# EAGLE board CFT-PB3-revB (EAGLE 5.11), part 1 of 2
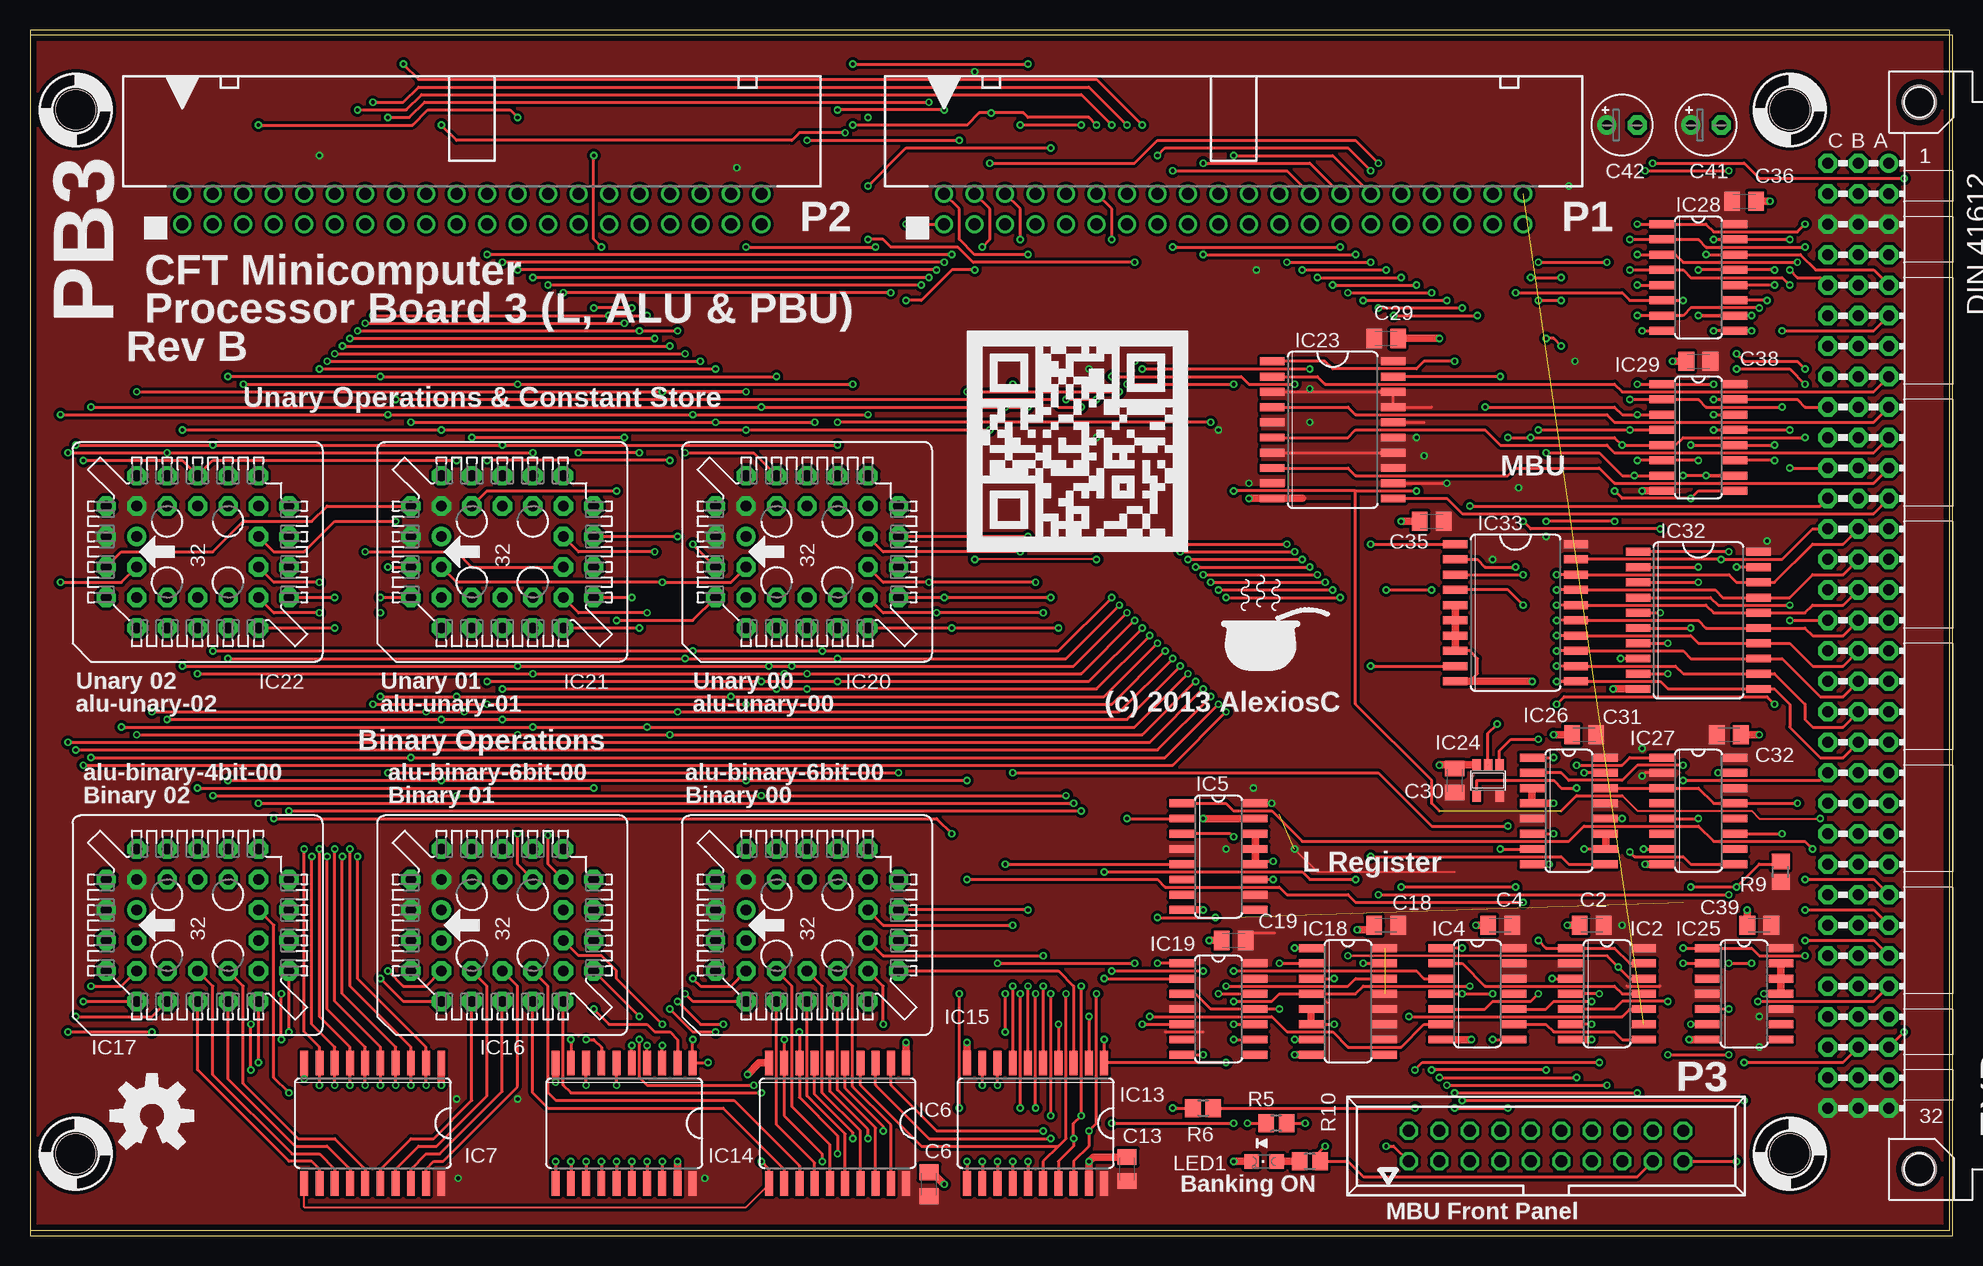
[diagram p7: board, top side]
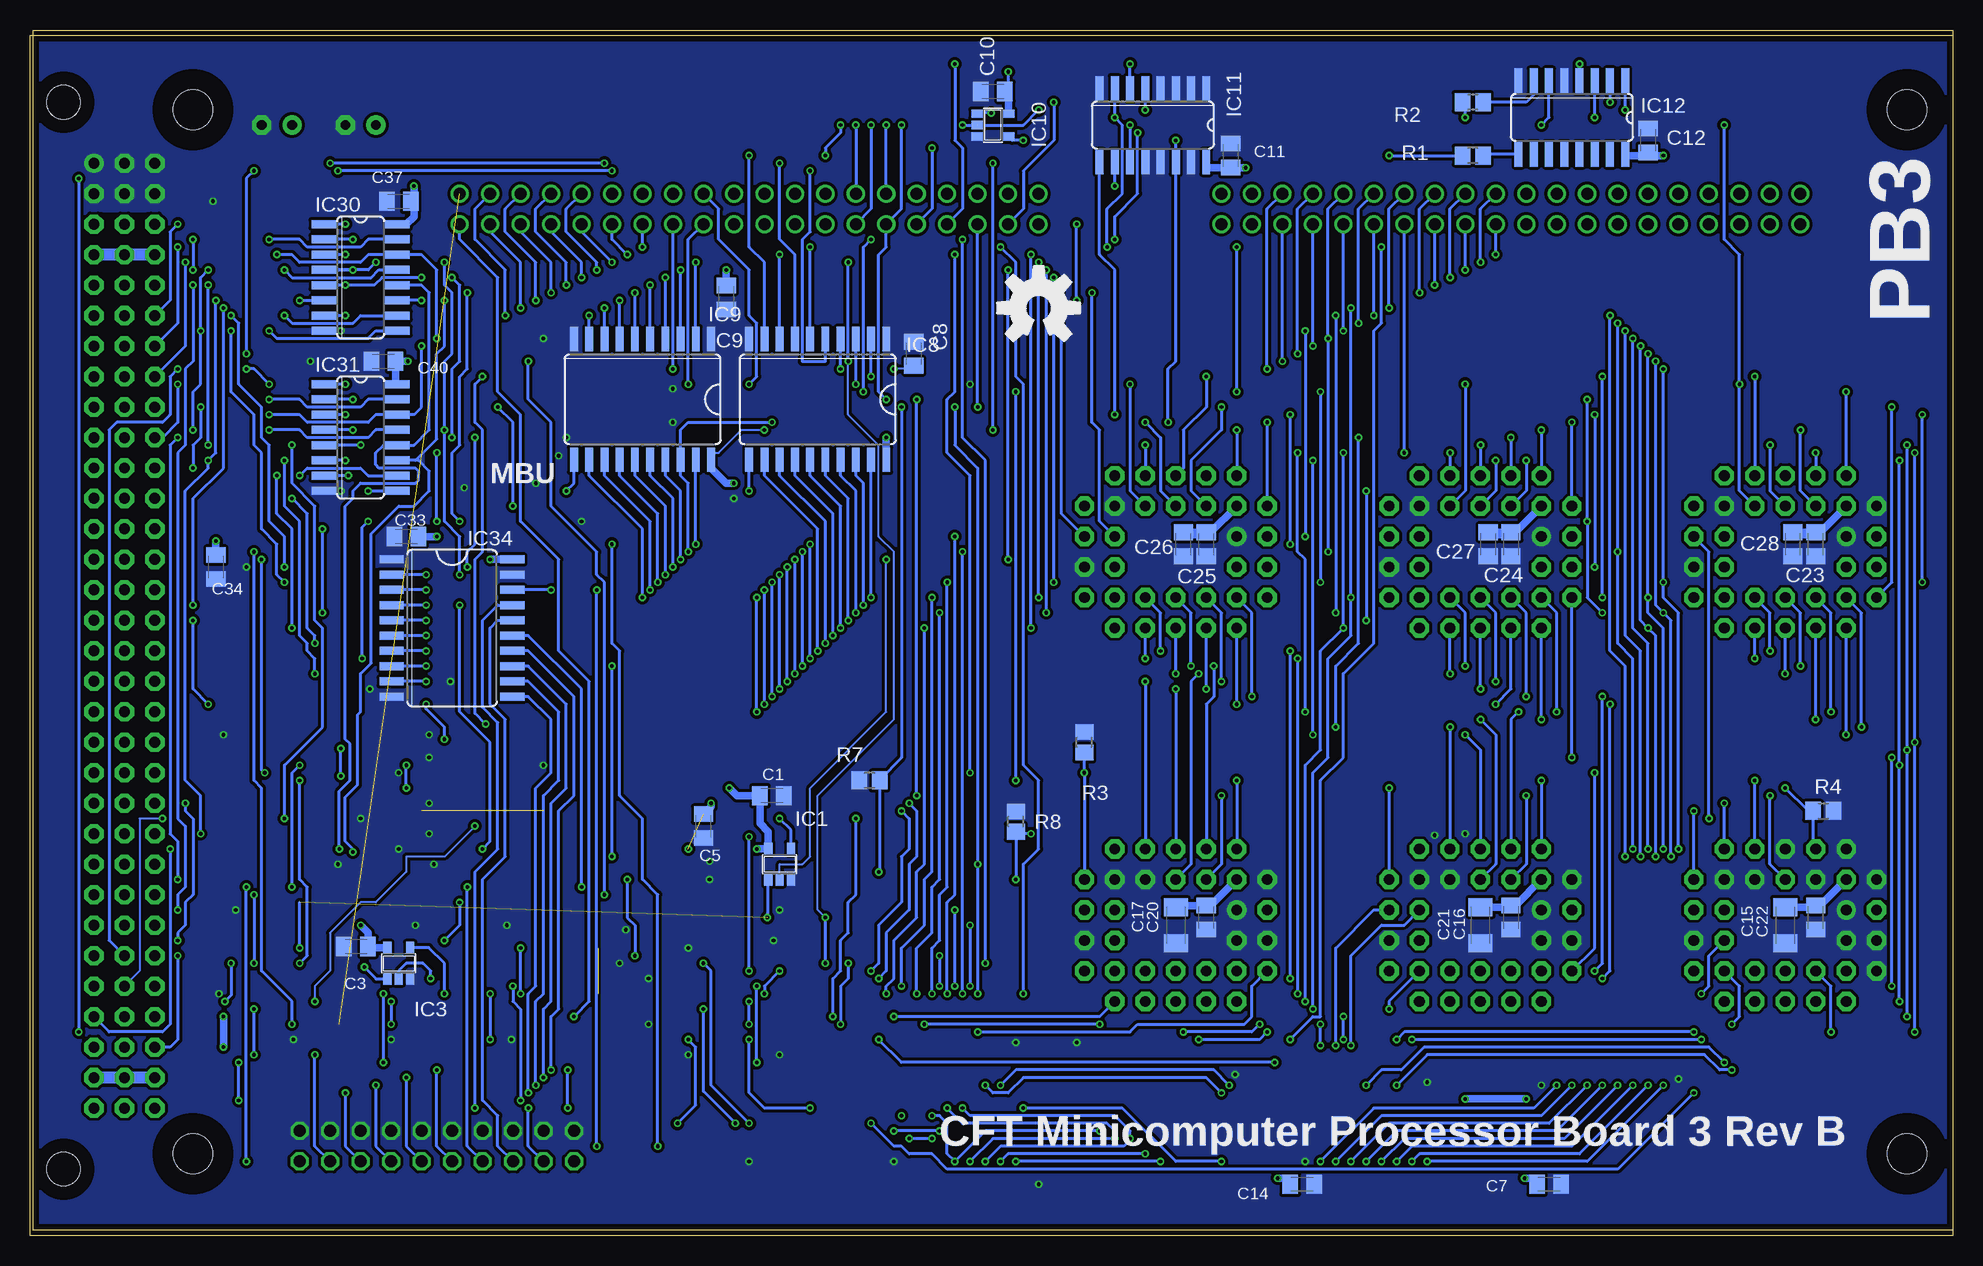
[diagram p8: board, bottom side, seen from below]

Size 160 x 100 mm. Coordinates in mm from the lower left corner, seen from the top.
Outline: 0,0 160,0 160,100 0,100 0,0
Copper layers (1*16): Top 0.035mm / dielectric 1.5mm / Bottom 0.035mm
Design rules "smart-prototyping *": minimum track width 7mil, minimum drill 12mil, track to track 7mil, track to pad 7mil, pad to pad 7mil, via to via 7mil, smd to smd 0mil, copper to edge 20mil, drill to drill 10mil, minimum pad ring 10mil, minimum via ring 6mil, stop-mask expansion 2mil, vias tented up to drill 25mil, thermal gap 10mil
Net classes: 0 default: width 0.152 mm, clearance 0.152 mm; 1 low power: width 0.152 mm, clearance 0.152 mm; 2 LED power: width 0.152 mm, clearance 0.152 mm
bRestrict: area 150.5,83.3 to 154.3,84.6

## Footprints (pad centres in the part's own frame; a part is rotated, then mirrored left to right if it is on the bottom)
C0805K = smd 1.3 x 1.6: 1 -1,0; 2 1,0
C1206K = smd 1.5 x 2: 1 -1.5,0; 2 1.5,0
E2,5-5 = drill 0.813 pad 1.6 round: + -1.27,0 | drill 0.813 pad 1.6 octagon: - 1.27,0
VG96K = drill 0.914 pad 1.6 round: A1 154.94,39.37 | drill 0.914 pad 1.6 octagon: A2 154.94,36.83; A3 154.94,34.29; A4 154.94,31.75; A5 154.94,29.21; A6 154.94,26.67; A7 154.94,24.13; A8 154.94,21.59; A9 154.94,19.05; A10 154.94,16.51; A11 154.94,13.97; A12 154.94,11.43; A13 154.94,8.89; A14 154.94,6.35; A15 154.94,3.81; A16 154.94,1.27; A17 154.94,-1.27; A18 154.94,-3.81; A19 154.94,-6.35; A20 154.94,-8.89; A21 154.94,-11.43; A22 154.94,-13.97; A23 154.94,-16.51; A24 154.94,-19.05; A25 154.94,-21.59; A26 154.94,-24.13; A27 154.94,-26.67; A28 154.94,-29.21; A29 154.94,-31.75; A30 154.94,-34.29; A31 154.94,-36.83; A32 154.94,-39.37; B1 152.4,39.37; B2 152.4,36.83; B3 152.4,34.29; B4 152.4,31.75; B5 152.4,29.21; B6 152.4,26.67; B7 152.4,24.13; B8 152.4,21.59; B9 152.4,19.05; B10 152.4,16.51; B11 152.4,13.97; B12 152.4,11.43; B13 152.4,8.89; B14 152.4,6.35; B15 152.4,3.81; B16 152.4,1.27; B17 152.4,-1.27; B18 152.4,-3.81; B19 152.4,-6.35; B20 152.4,-8.89; B21 152.4,-11.43; B22 152.4,-13.97; B23 152.4,-16.51; B24 152.4,-19.05; B25 152.4,-21.59; B26 152.4,-24.13; B27 152.4,-26.67; B28 152.4,-29.21; B29 152.4,-31.75; B30 152.4,-34.29; B31 152.4,-36.83; B32 152.4,-39.37; C1 149.86,39.37; C2 149.86,36.83; C3 149.86,34.29; C4 149.86,31.75; C5 149.86,29.21; C6 149.86,26.67; C7 149.86,24.13; C8 149.86,21.59; C9 149.86,19.05; C10 149.86,16.51; C11 149.86,13.97; C12 149.86,11.43; C13 149.86,8.89; C14 149.86,6.35; C15 149.86,3.81; C16 149.86,1.27; C17 149.86,-1.27; C18 149.86,-3.81; C19 149.86,-6.35; C20 149.86,-8.89; C21 149.86,-11.43; C22 149.86,-13.97; C23 149.86,-16.51; C24 149.86,-19.05; C25 149.86,-21.59; C26 149.86,-24.13; C27 149.86,-26.67; C28 149.86,-29.21; C29 149.86,-31.75; C30 149.86,-34.29; C31 149.86,-36.83; C32 149.86,-39.37 | hole 2.794: 157.48,44.45; 157.48,-44.45
SOT23-5 = smd 0.69 x 0.99: 1 -0.95,-1.29; 2 0,-1.29; 3 0.95,-1.29; 4 0.95,1.3; 5 -0.95,1.3
SO14 = smd 0.66 x 2.032: 1 -3.81,-3.073; 2 -2.54,-3.073; 3 -1.27,-3.073; 4 0,-3.073; 5 1.27,-3.073; 6 2.54,-3.073; 7 3.81,-3.073; 8 3.81,3.073; 9 2.54,3.073; 10 1.27,3.073; 11 0,3.073; 12 -1.27,3.073; 13 -2.54,3.073; 14 -3.81,3.073
SO16 = smd 0.66 x 2.032: 1 -4.445,-3.073; 2 -3.175,-3.073; 3 -1.905,-3.073; 4 -0.635,-3.073; 5 0.635,-3.073; 6 1.905,-3.073; 7 3.175,-3.073; 8 4.445,-3.073; 9 4.445,3.073; 10 3.175,3.073; 11 1.905,3.073; 12 0.635,3.073; 13 -0.635,3.073; 14 -1.905,3.073; 15 -3.175,3.073; 16 -4.445,3.073
SO20W = smd 0.66 x 2.032: 1 -5.715,-5.029; 2 -4.445,-5.029; 3 -3.175,-5.029; 4 -1.905,-5.029; 5 -0.635,-5.029; 6 0.635,-5.029; 7 1.905,-5.029; 8 3.175,-5.029; 9 4.445,-5.029; 10 5.715,-5.029; 11 5.715,5.029; 12 4.445,5.029; 13 3.175,5.029; 14 1.905,5.029; 15 0.635,5.029; 16 -0.635,5.029; 17 -1.905,5.029; 18 -3.175,5.029; 19 -4.445,5.029; 20 -5.715,5.029
PLCC32 = drill 0.9 pad 1.6 round: 1 1.27,5.08 | drill 0.9 pad 1.6 octagon: 2 -1.27,7.62; 3 -1.27,5.08; 4 -3.81,7.62; 5 -6.35,5.08; 6 -3.81,5.08; 7 -6.35,2.54; 8 -3.81,2.54; 9 -6.35,0; 10 -3.81,0; 11 -6.35,-2.54; 12 -3.81,-2.54; 13 -6.35,-5.08; 14 -3.81,-7.62; 15 -3.81,-5.08; 16 -1.27,-7.62; 17 -1.27,-5.08; 18 1.27,-7.62; 19 1.27,-5.08; 20 3.81,-7.62; 21 6.35,-5.08; 22 3.81,-5.08; 23 6.35,-2.54; 24 3.81,-2.54; 25 6.35,0; 26 3.81,0; 27 6.35,2.54; 28 3.81,2.54; 29 6.35,5.08; 30 3.81,7.62; 31 3.81,5.08; 32 1.27,7.62
CHIPLED_0805 = smd 1.2 x 1.2: A 0,-1.05; C 0,1.05
PAK100/2500-5-40 = drill 1 pad 1.422 round: 1 -24.13,-1.27; 2 -24.13,1.27; 3 -21.59,-1.27; 4 -21.59,1.27; 5 -19.05,-1.27; 6 -19.05,1.27; 7 -16.51,-1.27; 8 -16.51,1.27; 9 -13.97,-1.27; 10 -13.97,1.27; 11 -11.43,-1.27; 12 -11.43,1.27; 13 -8.89,-1.27; 14 -8.89,1.27; 15 -6.35,-1.27; 16 -6.35,1.27; 17 -3.81,-1.27; 18 -3.81,1.27; 19 -1.27,-1.27; 20 -1.27,1.27; 21 1.27,-1.27; 22 1.27,1.27; 23 3.81,-1.27; 24 3.81,1.27; 25 6.35,-1.27; 26 6.35,1.27; 27 8.89,-1.27; 28 8.89,1.27; 29 11.43,-1.27; 30 11.43,1.27; 31 13.97,-1.27; 32 13.97,1.27; 33 16.51,-1.27; 34 16.51,1.27; 35 19.05,-1.27; 36 19.05,1.27; 37 21.59,-1.27; 38 21.59,1.27; 39 24.13,-1.27; 40 24.13,1.27
057-020-1 = drill 1 octagon: 1 -11.43,-1.27; 2 -11.43,1.27; 3 -8.89,-1.27; 4 -8.89,1.27; 5 -6.35,-1.27; 6 -6.35,1.27; 7 -3.81,-1.27; 8 -3.81,1.27; 9 -1.27,-1.27; 10 -1.27,1.27; 11 1.27,-1.27; 12 1.27,1.27; 13 3.81,-1.27; 14 3.81,1.27; 15 6.35,-1.27; 16 6.35,1.27; 17 8.89,-1.27; 18 8.89,1.27; 19 11.43,-1.27; 20 11.43,1.27
R0805 = smd 1.3 x 1.5: 1 -0.85,0; 2 0.85,0
STANDOFF_28_60 = hole 3.302: 0,0

## Placement (x,y rotation side)
$4_37_$  SIGNATURESILK  [SIGNATURE]  99.69,46.35 0 top
$4_39_$  OSHW-LOGOL  [OSHW-LOGO-L]  10.16,9.53 0 top
$4_39_$1  OSHW-LOGOL  [OSHW-LOGO-L]  76.2,76.83 0 bottom
$4_40_$  QRCODE-CFT  [CFT-QRCODE]  78.11,56.52 0 top
C1  0.1uF  [C0805K]  98.42,36.2 180 bottom
C2  0.1uF  [C0805K]  130.18,25.4 0 top
C3  0.1uF  [C0805K]  133.1,23.62 0 bottom
C4  0.1uF  [C0805K]  122.56,25.4 0 top
C5  0.1uF  [C0805K]  104.14,33.66 90 bottom
C6  0.1uF  [C0805K]  74.93,3.81 270 top
C7  0.1uF  [C0805K]  33.66,3.81 180 bottom
C8  0.1uF  [C0805K]  86.61,73.03 270 bottom
C9  0.1uF  [C0805K]  102.23,77.72 90 bottom
C10  0.1uF  [C0805K]  80.01,94.87 0 bottom
C11  0.1uF  [C0805K]  60.2,89.53 270 bottom
C12  0.1uF  [C0805K]  25.4,90.81 270 bottom
C13  0.1uF  [C0805K]  91.44,5.08 270 top
C14  0.1uF  [C0805K]  54.23,3.81 180 bottom
C15  0.1uF  [C0805K]  11.43,26.04 90 bottom
C16  0.1uF  [C0805K]  36.83,26.04 90 bottom
C17  0.1uF  [C0805K]  62.23,26.04 90 bottom
C18  0.1uF  [C0805K]  113.03,25.4 0 top
C19  0.1uF  [C0805K]  100.33,24.13 0 top
C20  1uF  [C1206K]  64.77,25.4 270 bottom
C21  1uF  [C1206K]  39.37,25.4 270 bottom
C22  1uF  [C1206K]  13.97,25.4 270 bottom
C23  0.1uF  [C0805K]  11.43,57.15 90 bottom
C24  0.1uF  [C0805K]  36.83,57.15 90 bottom
C25  0.1uF  [C0805K]  62.23,57.15 90 bottom
C26  1uF  [C0805K]  64.14,57.15 270 bottom
C27  1uF  [C0805K]  38.73,57.15 270 bottom
C28  1uF  [C0805K]  13.34,57.15 270 bottom
C29  0.1uF  [C0805K]  113.03,74.3 180 top
C30  0.1uF  [C0805K]  118.75,37.47 270 top
C31  0.1uF  [C0805K]  129.54,41.27 0 top
C32  0.1uF  [C0805K]  141.6,41.27 180 top
C33  0.1uF  [C0805K]  128.91,57.78 0 bottom
C34  0.1uF  [C0805K]  144.78,55.24 90 bottom
C35  0.1uF  [C0805K]  116.84,59.05 0 top
C36  0.1uF  [C0805K]  142.88,85.72 180 top
C37  0.1uF  [C0805K]  129.54,85.72 0 bottom
C38  0.1uF  [C0805K]  139.06,72.39 0 top
C39  0.1uF  [C0805K]  144.15,25.4 0 top
C40  0.1uF  [C0805K]  130.81,72.39 0 bottom
C41  47uF  [E2,5-5]  139.7,92.08 0 top
C42  1uF  [E2,5-5]  132.72,92.08 0 top
EXP  [VG96K]  0,49.53 0 top
IC1  74AHC1G08DBV  [SOT23-5]  97.79,30.48 0 bottom
IC2  74HC00D  [SO14]  131.44,19.68 270 top
IC3  74AHC1G08DBV  [SOT23-5]  129.54,22.23 0 bottom
IC4  74HC32D  [SO14]  120.65,19.68 270 top
IC5  74HC112D  [SO16]  99.06,31.11 270 top
IC6  74HC574D  [SO20W]  67.31,8.89 180 top
IC7  74HC574D  [SO20W]  28.57,8.89 180 top
IC8  74HC574D  [SO20W]  94.61,69.22 180 bottom
IC9  74HC574D  [SO20W]  109.22,69.22 180 bottom
IC10  74AHC1G32DBV  [SOT23-5]  80.01,92.08 270 bottom
IC11  74HC253D  [SO16]  66.67,92.08 180 bottom
IC12  74HC138D  [SO16]  31.75,92.71 180 bottom
IC13  74HC541DW  [SO20W]  83.82,8.89 180 top
IC14  74HC541DW  [SO20W]  49.53,8.89 180 top
IC15  29F040  [PLCC32]  64.77,25.4 90 top
IC16  29F040  [PLCC32]  39.37,25.4 90 top
IC17  29F040  [PLCC32]  13.97,25.4 90 top
IC18  74HC253D  [SO16]  109.86,19.05 270 top
IC19  74HC74D  [SO14]  99.06,18.41 270 top
IC20  29F040  [PLCC32]  64.77,56.52 90 top
IC21  29F040  [PLCC32]  39.37,56.52 90 top
IC22  29F040  [PLCC32]  13.97,56.52 90 top
IC23  74HC688DW  [SO20W]  108.58,66.67 270 top
IC24  74AHC1G08DBV  [SOT23-5]  121.54,37.47 180 top
IC25  74HC74D  [SO14]  142.88,19.68 270 top
IC26  74HC253D  [SO16]  128.27,34.92 270 top
IC27  74HC139D  [SO16]  139.06,34.92 270 top
IC28  74HC670D  [SO16]  139.06,79.38 270 top
IC29  74HC670D  [SO16]  139.06,66.04 270 top
IC30  74HC670D  [SO16]  132.72,79.38 270 bottom
IC31  74HC670D  [SO16]  132.72,66.04 270 bottom
IC32  74HC541DW  [SO20W]  139.06,50.8 270 top
IC33  74HC541DW  [SO20W]  123.83,51.44 270 top
IC34  74HC541DW  [SO20W]  125.09,50.16 270 bottom
LED1  LED-5MM-GREEN  [CHIPLED_0805]  102.87,5.71 90 top
P1  2540-5  [PAK100/2500-5-40]  100.33,85.09 0 top
P2  2540-5  [PAK100/2500-5-40]  36.83,85.09 0 top
P3  057-020-1  [057-020-1]  126.36,6.99 0 top
R1  30R  [R0805]  40.01,89.53 180 bottom
R2  30R  [R0805]  40.01,93.98 180 bottom
R3  4k7  [R0805]  72.39,40.64 90 bottom
R4  4k7  [R0805]  10.79,34.92 0 bottom
R5  30R  [R0805]  103.89,8.89 180 top
R6  30R  [R0805]  97.79,10.16 0 top
R7  4k7  [R0805]  90.3,37.47 180 bottom
R8  4k7  [R0805]  78.11,34.04 90 bottom
R9  4k7  [R0805]  145.92,29.84 90 top
R10  330R  [R0805]  106.68,5.71 180 top
U1  HOLE  [STANDOFF_28_60]  3.81,93.34 0 top
U2  HOLE  [STANDOFF_28_60]  3.81,6.35 0 top
U3  HOLE  [STANDOFF_28_60]  146.69,6.35 0 top
U4  HOLE  [STANDOFF_28_60]  146.69,93.34 0 top